# Altium schematic sheet FT231X_BRK.SchDoc: FT231 breakout board
size A4; Author: Grzegorz Gajoch; DrawnBy: Grzegorz Gajoch; Engineer: Grzegorz Gajoch; Revision: 1.0; SheetNumber: 1; SheetTotal: 1; ProjectName: FT231 breakout board
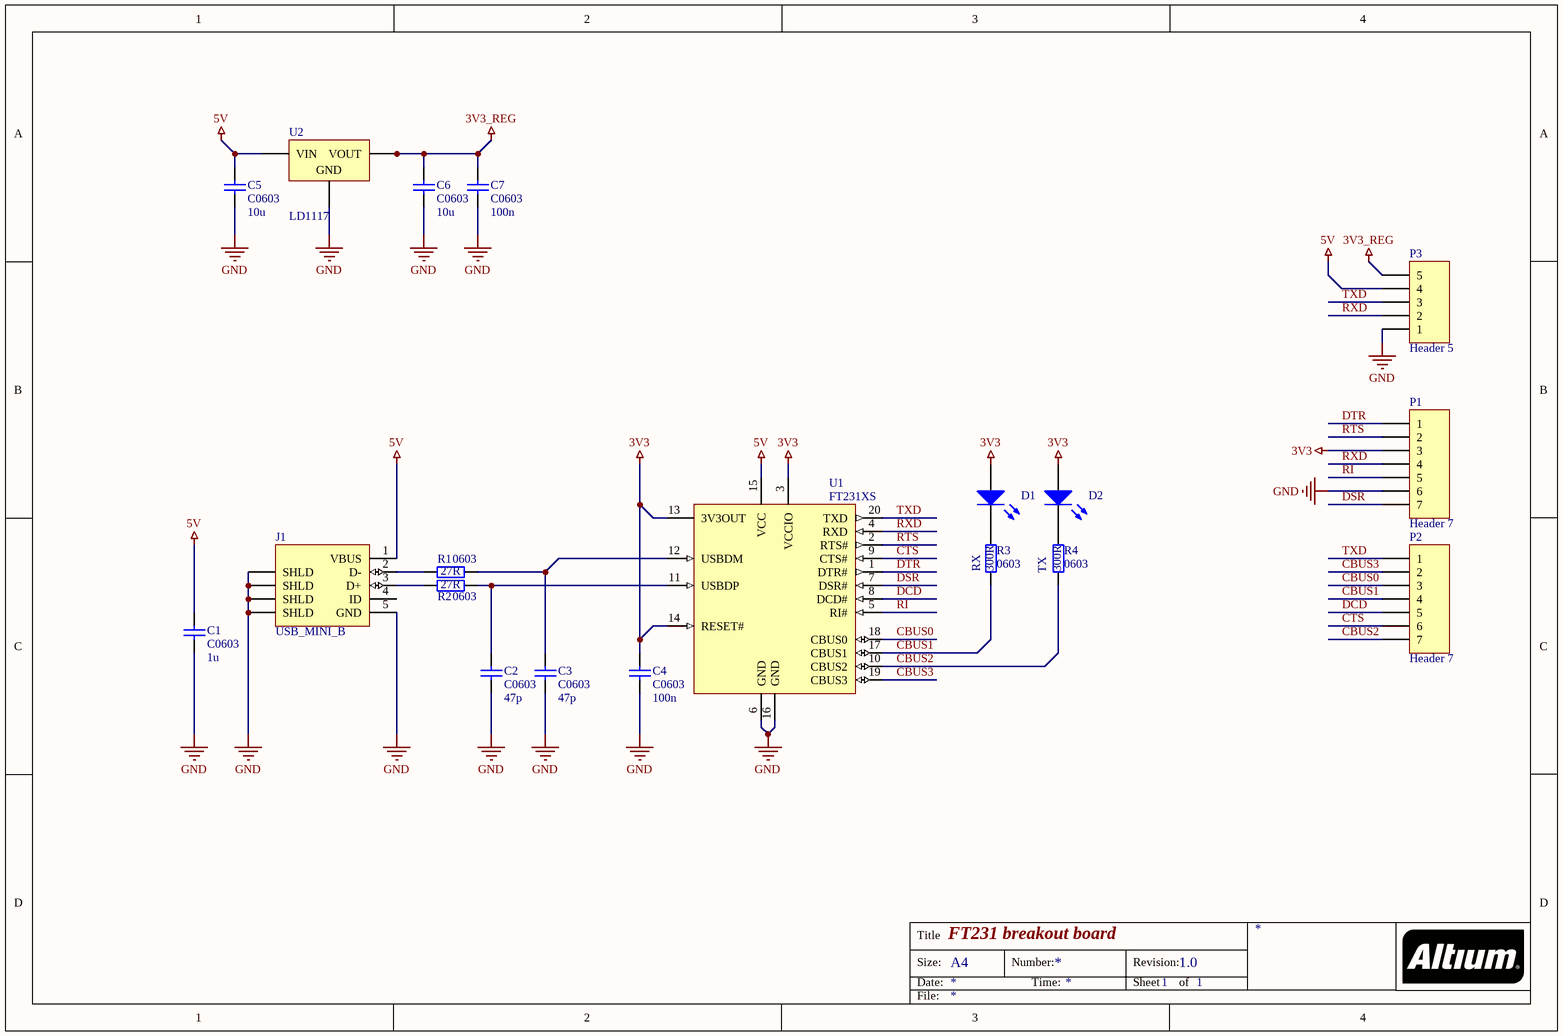
[diagram p0: FT231X_BRK.SchDoc]

## Parts
C1  1u  [C0603]
C2  47p  [C0603]
C3  47p  [C0603]
C4  100n  [C0603]
C5  10u  [C0603]
C6  10u  [C0603]
C7  100n  [C0603]
D1  LEDX  [LED 0805 Blue]  (value not drawn)
D2  LEDX  [LED 0805 Blue]  (value not drawn)
J1  USB_MINI_B  [USB_Mini_B_9.3x7.7]
P1  Header 7  [HEADER 1X7 MALE]
P2  Header 7  [HEADER 1X7 MALE]
P3  Header 5  [HEADER 1X5 MALE]
R1  27R  [0603]
R2  27R  [0603]
R3  300R  [0603]
R4  300R  [0603]
U1  FT231XS  [SSOP20_M]
U2  LD1117  [TO-252]

## Nets
3V3: C4.1 D1.1(A) D2.1(A) P1.3 U1.3(VCCIO) U1.13(3V3OUT) U1.14(RESET#)
3V3_REG: C6.1 C7.1 P3.5 U2.2(VOUT) U2.4(VOUT) U2.5(VOUT) U2.6(VOUT)
5V: C1.1 C5.1 J1.1(VBUS) P3.4 U1.15(VCC) U2.3(VIN)
GND: C1.2 C2.2 C3.2 C4.2 C5.2 C6.2 C7.2 J1.5(GND) J1.MH1(SHLD) J1.MH2(SHLD) J1.MH3(SHLD) J1.MH4(SHLD) P1.6 P3.1 U1.6(GND) U1.16(GND) U2.1(GND)
CBUS0: P2.3 U1.18(CBUS0)
CBUS1: P2.4 R3.2 U1.17(CBUS1)
CBUS2: P2.7 R4.2 U1.10(CBUS2)
CBUS3: P2.2 U1.19(CBUS3)
CTS: P2.6 U1.9(CTS#)
DCD: P2.5 U1.8(DCD#)
DSR: P1.7 U1.7(DSR#)
DTR: P1.1 U1.1(DTR#)
RI: P1.5 U1.5(RI#)
RTS: P1.2 U1.2(RTS#)
RXD: P1.4 P3.2 U1.4(RXD)
TXD: P2.1 P3.3 U1.20(TXD)
NetC2_1: C2.1 R2.2 U1.11(USBDP)
NetC3_1: C3.1 R1.2 U1.12(USBDM)
NetD1_2: D1.2(K) R3.1
NetD2_2: D2.2(K) R4.1
NetJ1_2: J1.2(D-) R1.1
NetJ1_3: J1.3(D+) R2.1

Not connected (* = marked no-connect by the designer): J1 4(ID)

## Notes on the sheet
- (near R3) RX
- (near R4) TX
- Title
- Size:
- Date:
- A4
- Number:
- Time:
- Revision:
- Sheet
- of
- File:

## Library data of the parts
C1-C7 = Cap: Generic capacitor; Packge: C0603
  C1: Value: 1u
  C2 C3: Value: 47p
  C4 C7: Value: 100n
  C5 C6: Value: 10u
D1 D2 = LEDX: Typical LED
J1 = USB_MINI_B2: USB On-The-Go (OTG) Mini-B Receptacle
P1 P2 = Header 7: Header, 7-Pin; LatestRevisionDate: 17-Jul-2002; LatestRevisionNote: Re-released for DXP Platform.; Publisher: Altium Limited
P3 = Header 5: Header, 5-Pin; LatestRevisionDate: 17-Jul-2002; LatestRevisionNote: Re-released for DXP Platform.; Publisher: Altium Limited
R1-R4 = Res: Generic resistor; Package: 0603
  R1 R2: Value: 27R
  R3 R4: Value: 300R
U1 = FT231XS: USB to Full-Handshake UART Interface Chip, UHCI/OHCI/EHCI Compatible, USB 2.0 Compatible, -40 to +85 degC, 20-Pin SSOP, Pb-Free, Tube; Manufacturer: FTDI; PartNumber: FT231XS-U; DatasheetVersion: ver 1.2, Feb-2013; PackageVersion: Feb-13; PackageReference: SSOP-20; PackageDescription: 20-Pin Small Outline Package, 8.6 x 3.9 mm Body, 0.635 mm Pitch; Code_JEDEC: MO-137-AD; ComponentLink1Description: Manufacturer URL; ComponentLink1URL: http://www.ftdichip.com/; ComponentLink2Description: Datasheet; ComponentLink2URL: http://www.ftdichip.com/Support/Documents/DataSheets/ICs/DS_FT231X.pdf; ComponentLink3Description: FT231X Product Page; ComponentLink3URL: www.ftdichip.com/Products/ICs/FT231X.html
U2 = LD1117: Low drop positive voltage regulator; pin to pad: 2>4 5>4 6>4; ComponentLink1URL: http://www.st.com/web/en/resource/technical/document/datasheet/CD00000544.pdf; ComponentLink1Description: Datasheet